# Altium schematic sheet [5]-OPI_MAIN.SchDoc
size A4
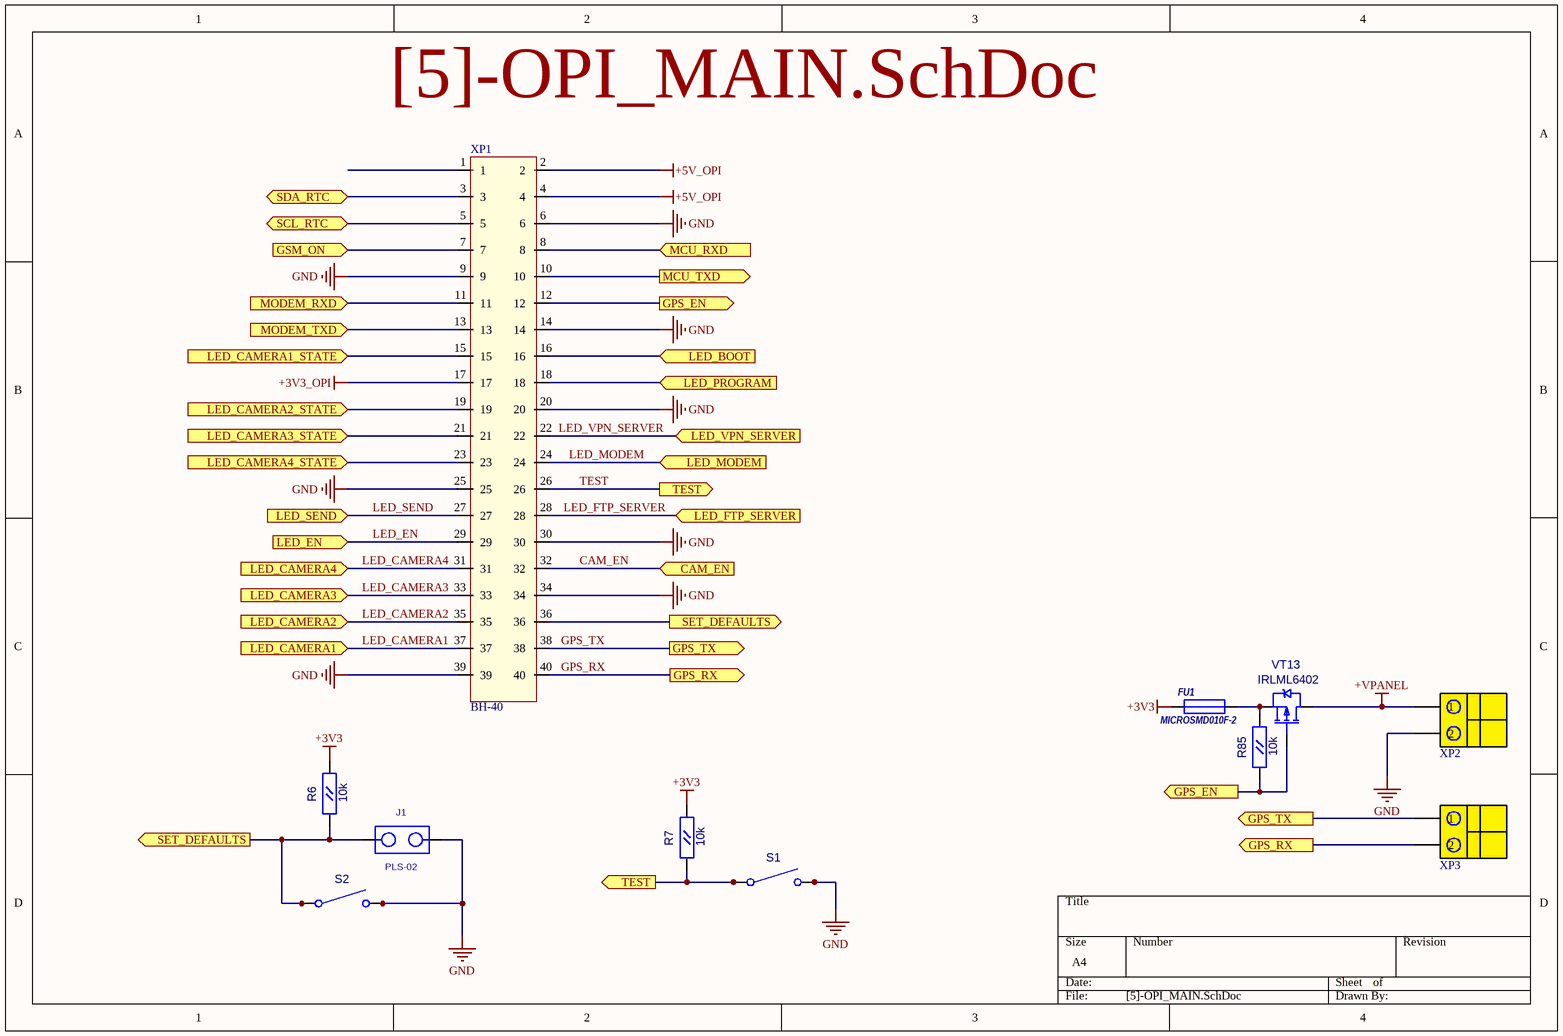
[diagram p0: [5]-OPI_MAIN.SchDoc]

## Parts
FU1  MICROSMD010F-2  [RC1210]
J1  PLS-02  [PLS-02]
R6  10k  [RC0603]
R7  10k  [RC0603]
R85  10k  [RC0603]
S1  DTSM-61N  [DTSM-61N]  (value not drawn)
S2  DTSM-61N  [DTSM-61N]  (value not drawn)
VT13  IRLML6402  [SOT-23(123)]
XP1  BH-40  [BH-40]
XP2  DG330-2P  [DG330-2P]  (value not drawn)
XP3  DG330-2P  [DG330-2P]  (value not drawn)

## Ports
CAM_EN (in), GPS_EN (out), GPS_RX (out), GPS_TX (out), GSM_ON (in), LED_BOOT (in), LED_CAMERA1 (in), LED_CAMERA1_STATE (in), LED_CAMERA2 (in), LED_CAMERA2_STATE (in), LED_CAMERA3 (in), LED_CAMERA3_STATE (in), LED_CAMERA4 (in), LED_CAMERA4_STATE (in), LED_EN (in), LED_FTP_SERVER (in), LED_MODEM (in), LED_PROGRAM (in), LED_SEND (in), LED_VPN_SERVER (in), MCU_RXD (in), MCU_TXD (out), MODEM_RXD (in), MODEM_TXD (in), SCL_RTC (bidir), SDA_RTC (bidir), SET_DEFAULTS (out), TEST (out)

## Nets
+3V3: FU1.1 R6.2(B) R7.2(B)
+3V3_OPI: XP1.17
+5V_OPI: XP1.2 XP1.4
+VPANEL: VT13.3(D) XP2.1
GND: J1.2 S1.3(C2) S1.4 S2.3(C2) S2.4 XP1.6 XP1.9 XP1.14 XP1.20 XP1.25 XP1.30 XP1.34 XP1.39 XP2.2
CAM_EN: XP1.32 ; port CAM_EN
GPS_EN: R85.1(A) VT13.1(G) XP1.12 ; port GPS_EN
GPS_RX: XP1.40 XP3.2 ; port GPS_RX
GPS_TX: XP1.38 XP3.1 ; port GPS_TX
GSM_ON: XP1.7 ; port GSM_ON
LED_BOOT: XP1.16 ; port LED_BOOT
LED_CAMERA1: XP1.37 ; port LED_CAMERA1
LED_CAMERA1_STATE: XP1.15 ; port LED_CAMERA1_STATE
LED_CAMERA2: XP1.35 ; port LED_CAMERA2
LED_CAMERA2_STATE: XP1.19 ; port LED_CAMERA2_STATE
LED_CAMERA3: XP1.33 ; port LED_CAMERA3
LED_CAMERA3_STATE: XP1.21 ; port LED_CAMERA3_STATE
LED_CAMERA4: XP1.31 ; port LED_CAMERA4
LED_CAMERA4_STATE: XP1.23 ; port LED_CAMERA4_STATE
LED_EN: XP1.29 ; port LED_EN
LED_FTP_SERVER: XP1.28 ; port LED_FTP_SERVER
LED_MODEM: XP1.24 ; port LED_MODEM
LED_PROGRAM: XP1.18 ; port LED_PROGRAM
LED_SEND: XP1.27 ; port LED_SEND
LED_VPN_SERVER: XP1.22 ; port LED_VPN_SERVER
MCU_RXD: XP1.8 ; port MCU_RXD
MCU_TXD: XP1.10 ; port MCU_TXD
MODEM_RXD: XP1.11 ; port MODEM_RXD
MODEM_TXD: XP1.13 ; port MODEM_TXD
SCL_RTC: XP1.5 ; port SCL_RTC
SDA_RTC: XP1.3 ; port SDA_RTC
SET_DEFAULTS: J1.1 R6.1(A) S2.1(C1) S2.2 XP1.36 ; port SET_DEFAULTS
TEST: R7.1(A) S1.1(C1) S1.2 XP1.26 ; port TEST
NetFU1_2: FU1.2 R85.2(B) VT13.2(S)

Not connected (* = marked no-connect by the designer): XP1 1

## Library data of the parts
FU1 = MICROSMD: Value: *
R6 R7 R85 = RC0603: Value: 10k
S1 S2 = DTSM-61N: Switch, Single Pole, Single Throw, Normally Open; Value: {Value}
VT13 = IRLML6402: HEXFET Power MOSFET; OriginalName: IRLML5103; ComponentField7: Published 8-Jun-2000; Value: IRLML6402
XP1 = BH-40: 2.54mm connector with key; Value: BH-40
XP2 XP3 = DG330-2P: Degson 2 pin connector rear; Value: DG330-2P
J1 = PLS-02: Value: *